# EAGLE design ROM-el HN61256_v2_TH (EAGLE 7.7.0)
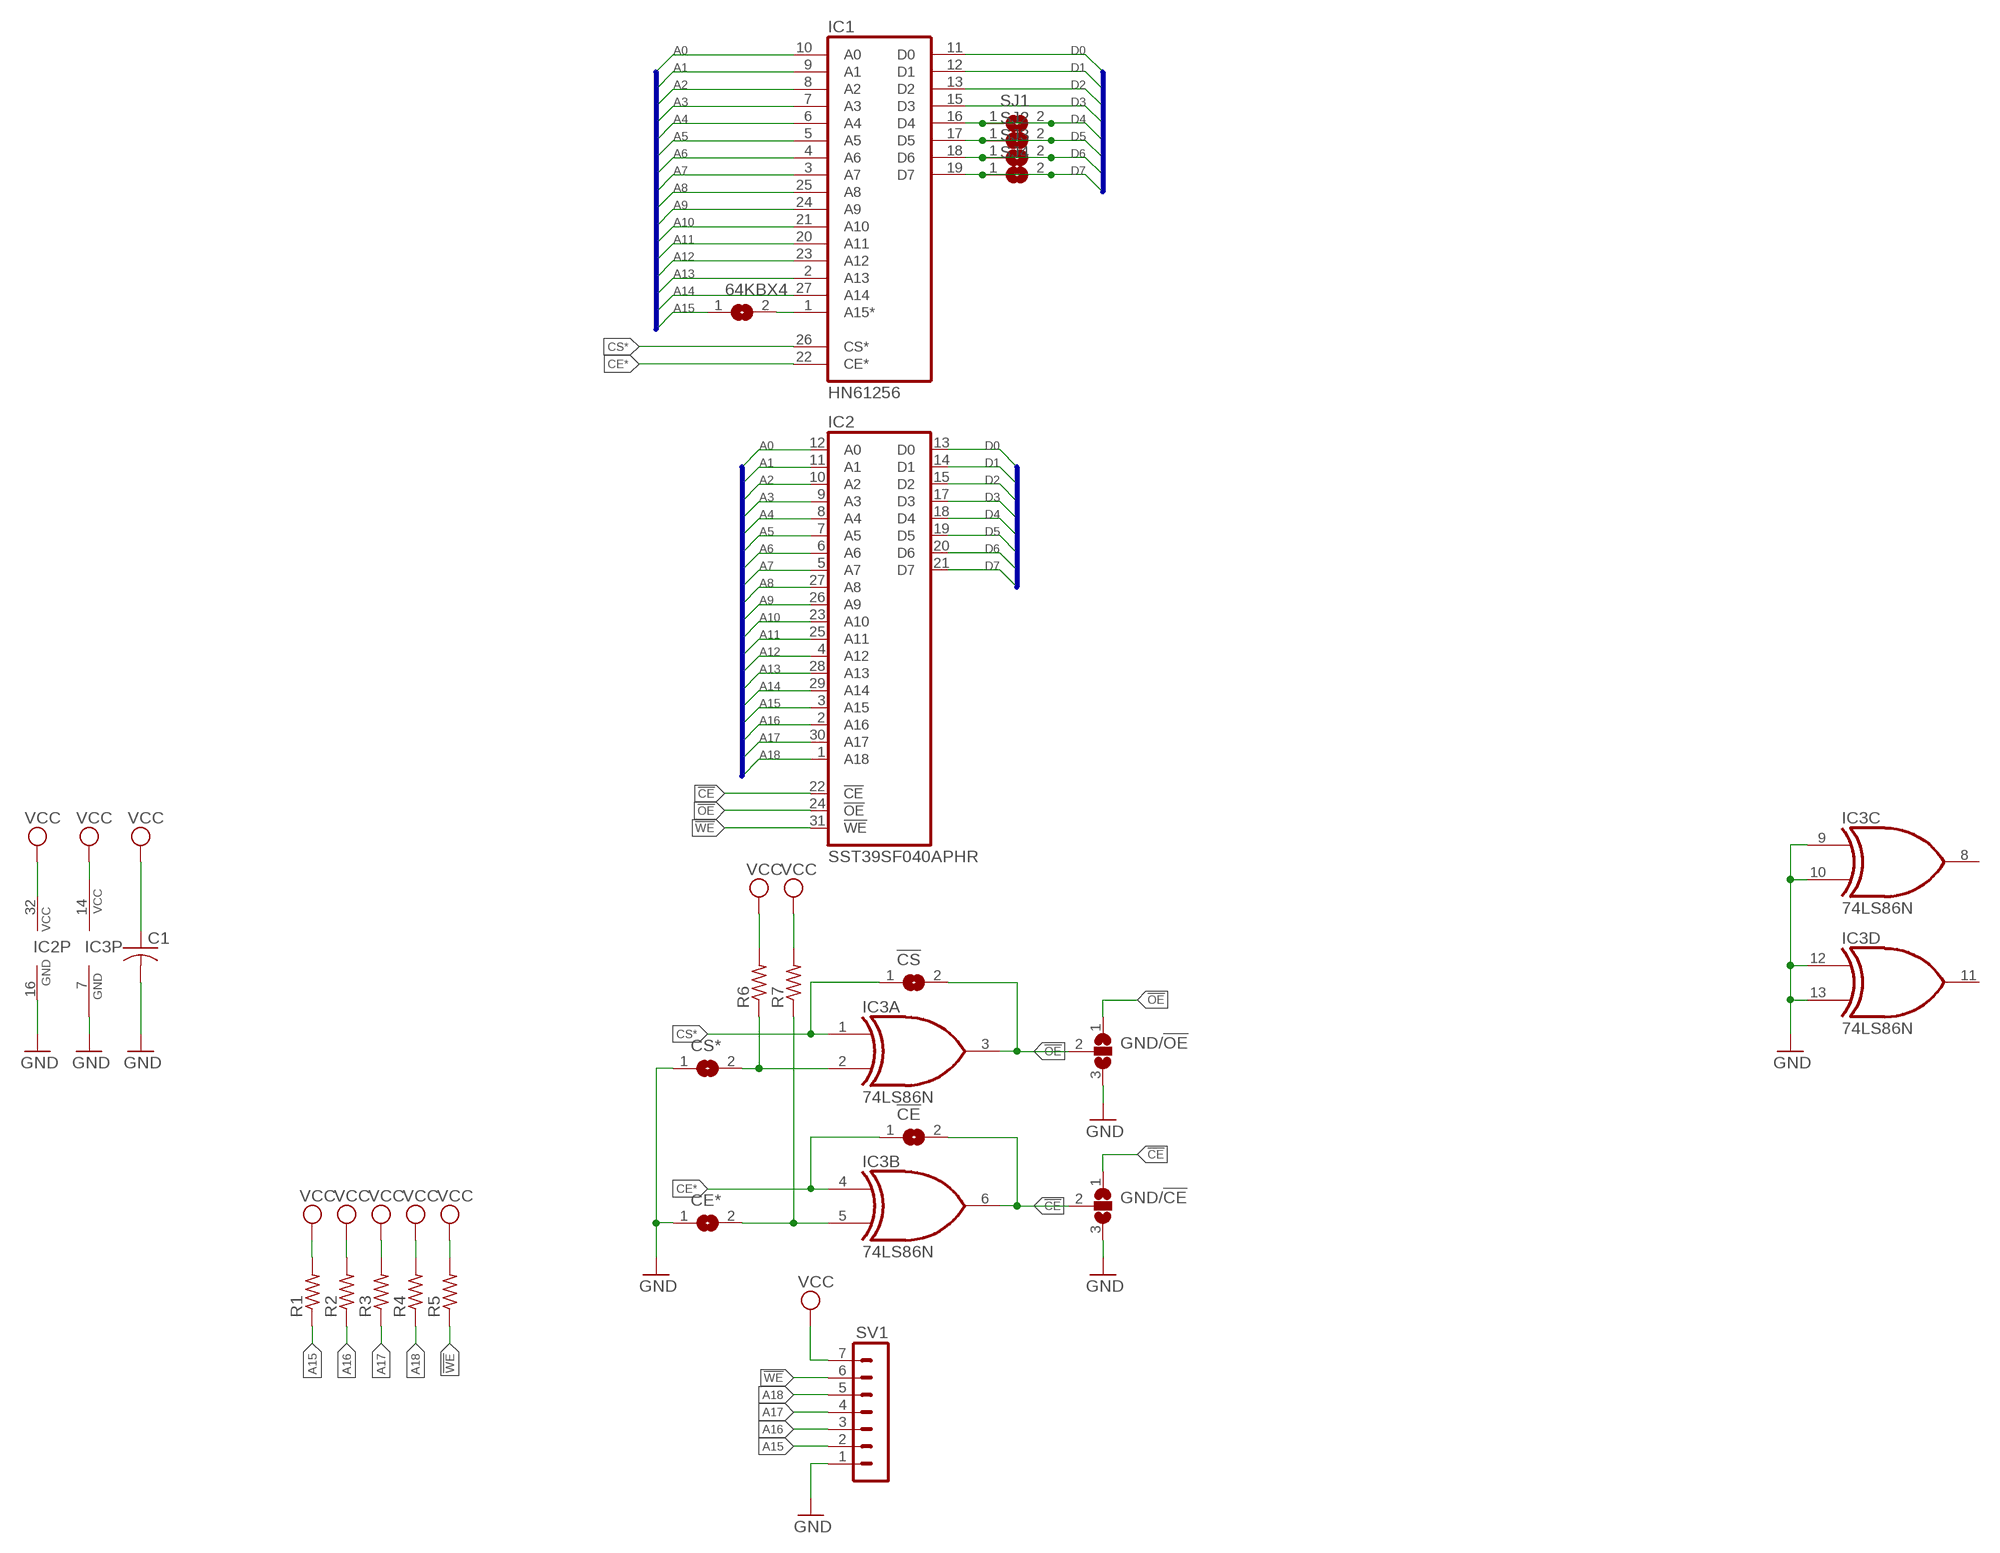
[diagram p0: schematic, sheet 1]

## Parts
64KBX4  SJ  [SJ]
!CE  SJ  [SJ]
!CS  SJ  [SJ]
C1  C-US025-025X050  [C025-025X050]
CE*  SJ  [SJ]
CS*  SJ  [SJ]
GND/!CE  SJ2W  [SJ_2]
GND/!OE  SJ2W  [SJ_2]
IC1  HN61256  [DIL28-6]
IC2  SST39SF040APHR  [DIL32-RP]
IC3  74LS86N  [DIL14-RP]
R1  R-US_0204/5  [0204/5]
R2  R-US_0204/5  [0204/5]
R3  R-US_0204/5  [0204/5]
R4  R-US_0204/5  [0204/5]
R5  R-US_0204/5  [0204/5]
R6  R-US_0204/5  [0204/5]
R7  R-US_0204/5  [0204/5]
SJ1  SJ  [SJ]
SJ2  SJ  [SJ]
SJ3  SJ  [SJ]
SJ4  SJ  [SJ]
SV1  MA07-1  [MA07-1]

## Nets
!CE: !CE.2 GND/!CE.1 GND/!CE.2 IC2.22(!CE) IC3.6(B:O)
!OE: !CS.2 GND/!OE.1 GND/!OE.2 IC2.24(!OE) IC3.3(A:O)
!WE: IC2.31(!WE) R5.1 SV1.6
A0: IC1.10(A0) IC2.12(A0)
A1: IC1.9(A1) IC2.11(A1)
A2: IC1.8(A2) IC2.10(A2)
A3: IC1.7(A3) IC2.9(A3)
A4: IC1.6(A4) IC2.8(A4)
A5: IC1.5(A5) IC2.7(A5)
A6: IC1.4(A6) IC2.6(A6)
A7: IC1.3(A7) IC2.5(A7)
A8: IC1.25(A8) IC2.27(A8)
A9: IC1.24(A9) IC2.26(A9)
A10: IC1.21(A10) IC2.23(A10)
A11: IC1.20(A11) IC2.25(A11)
A12: IC1.23(A12) IC2.4(A12)
A13: IC1.2(A13) IC2.28(A13)
A14: IC1.27(A14) IC2.29(A14)
A15: 64KBX4.1 IC2.3(A15) R1.1 SV1.2
A16: IC2.2(A16) R2.1 SV1.3
A17: IC2.30(A17) R3.1 SV1.4
A18: IC2.1(A18) R4.1 SV1.5
CE*: !CE.1 IC1.22(CE*) IC3.4(B:I0)
CS*: !CS.1 IC1.26(CS*) IC3.1(A:I0)
D0: IC1.11(D0) IC2.13(D0)
D1: IC1.12(D1) IC2.14(D1)
D2: IC1.13(D2) IC2.15(D2)
D3: IC1.15(D3) IC2.17(D3)
D4: IC1.16(D4) IC2.18(D4) SJ1.1 SJ1.2
D5: IC1.17(D5) IC2.19(D5) SJ2.1 SJ2.2
D6: IC1.18(D6) IC2.20(D6) SJ3.1 SJ3.2
D7: IC1.19(D7) IC2.21(D7) SJ4.1 SJ4.2
GND: C1.2 CE*.1 CS*.1 GND/!CE.3 GND/!OE.3 IC2.16(GND) IC3.7(P:GND) IC3.9(C:I0) IC3.10(C:I1) IC3.12(D:I0) IC3.13(D:I1) SV1.1
N$1: 64KBX4.2 IC1.1(A15*)
N$7: CS*.2 IC3.2(A:I1) R6.1
N$8: CE*.2 IC3.5(B:I1) R7.1
VCC: C1.1 IC2.32(VCC) IC3.14(P:VCC) R1.2 R2.2 R3.2 R4.2 R5.2 R6.2 R7.2 SV1.7
Unconnected: IC3.8(C:O) IC3.11(D:O)

## Buses
A[0..18]
D[0..7]

## Power pins joined to a net without a drawn wire
GND: IC1.14(GND)
VCC: IC1.28(VCC)

## Library data of the parts
64KBX4 !CE !CS CE* CS* SJ1-SJ4 = jumper-jlb:SJ: SMD solder JUMPER
C1 = rcl:C-US: CAPACITOR, American symbol
GND/!CE GND/!OE = jumper-jlb:SJ2W: SMD solder JUMPER
IC1 = memory-hitachi-jlb:HN61256
IC2 = memory-sst:SST39SF040A: 4 Mbit x8 Multi-Purpose Flash Source: http://www.sst.com/dotAsset/40782.pdf
IC3 = 74xx-us-jlb:74*86: Quad 2-input EXCLUSIV-OR (XOR) gate
R1-R7 = resistor:R-US_: RESISTOR, American symbol
SV1 = con-lstb-rp:MA07-1: PIN HEADER; OC_FARNELL: unknown; OC_NEWARK: unknown

## Board
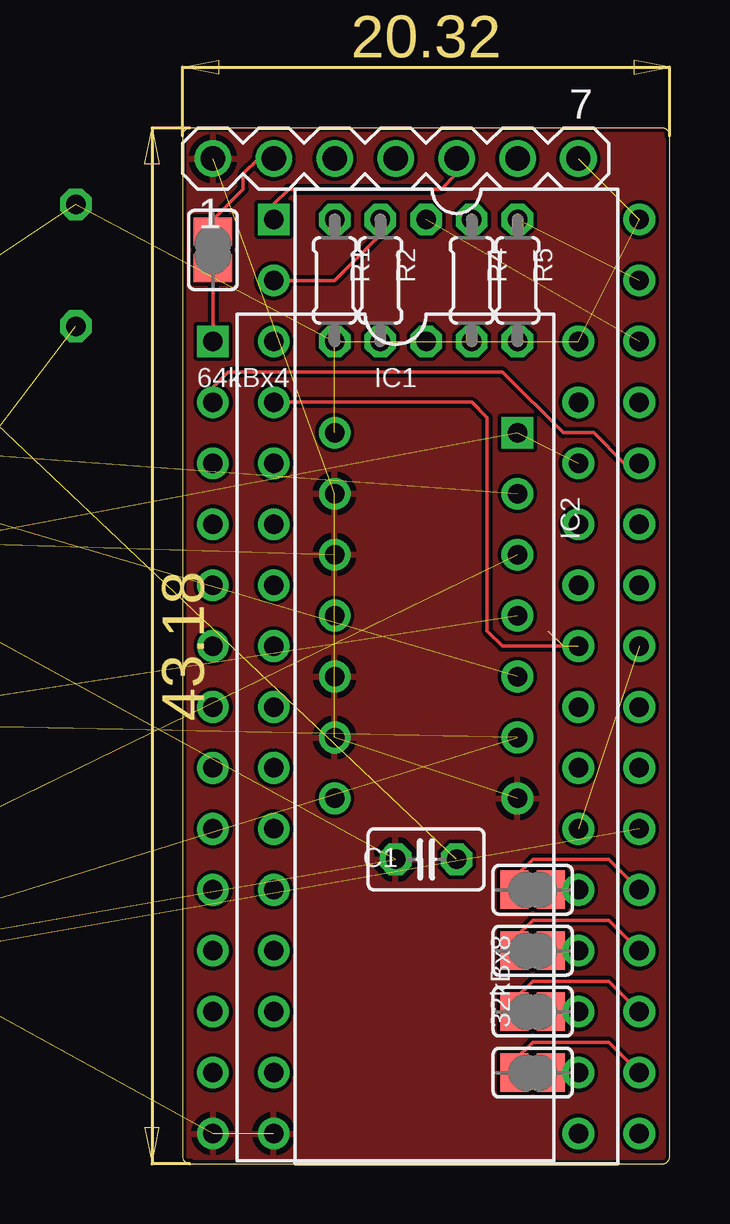
[diagram p1: board, top side]
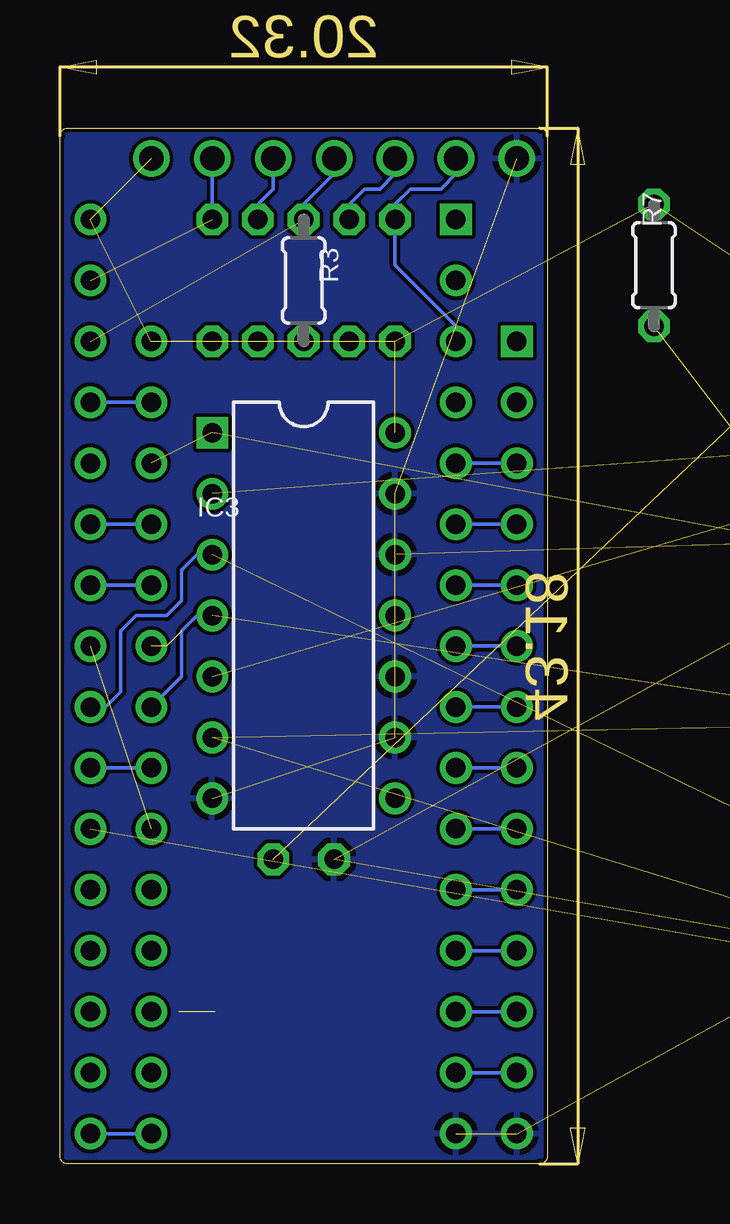
[diagram p2: board, bottom side, seen from below]

Size 20.32 x 43.18 mm. Coordinates in mm from the lower left corner, seen from the top.
Outline: 0,42.86 0,0.32 arc90 0.32,0 20,0 arc90 20.32,0.32 20.32,42.86 arc90 20,43.18 0.32,43.18 arc90 0,42.86
Copper layers (1*16): Top 0.035mm / dielectric 1.5mm / Bottom 0.035mm
Design rules "hackvana": minimum track width 6mil, minimum drill 0.3mm, track to track 6mil, track to pad 6mil, pad to pad 6mil, via to via 6mil, smd to smd 0mil, copper to edge 6mil, drill to drill 6mil, minimum pad ring 10mil, minimum via ring 6mil, stop-mask expansion 2mil, vias tented up to drill 100mil, thermal gap 10mil

### Footprints (pad centres in the part's own frame; a part is rotated, then mirrored left to right if it is on the bottom)
SJ = smd 1.168 x 1.6: 1 -0.762,0; 2 0.762,0
C025-025X050 = drill 0.813 octagon: 1 -1.27,0; 2 1.27,0
SJ_2 = smd 1.168 x 1.6: 1 -1.524,0; 2 0,0; 3 1.524,0
DIL28-6 = drill 0.813 square: 1 -16.51,-7.62 | drill 0.813: 2 -13.97,-7.62; 3 -11.43,-7.62; 4 -8.89,-7.62; 5 -6.35,-7.62; 6 -3.81,-7.62; 7 -1.27,-7.62; 8 1.27,-7.62; 9 3.81,-7.62; 10 6.35,-7.62; 11 8.89,-7.62; 12 11.43,-7.62; 13 13.97,-7.62; 14 16.51,-7.62; 15 16.51,7.62; 16 13.97,7.62; 17 11.43,7.62; 18 8.89,7.62; 19 6.35,7.62; 20 3.81,7.62; 21 1.27,7.62; 22 -1.27,7.62; 23 -3.81,7.62; 24 -6.35,7.62; 25 -8.89,7.62; 26 -11.43,7.62; 27 -13.97,7.62; 28 -16.51,7.62
DIL32-RP = drill 0.813 square: 1 -19.05,-7.62 | drill 0.813: 2 -16.51,-7.62; 3 -13.97,-7.62; 4 -11.43,-7.62; 5 -8.89,-7.62; 6 -6.35,-7.62; 7 -3.81,-7.62; 8 -1.27,-7.62; 9 1.27,-7.62; 10 3.81,-7.62; 11 6.35,-7.62; 12 8.89,-7.62; 13 11.43,-7.62; 14 13.97,-7.62; 15 16.51,-7.62; 16 19.05,-7.62; 17 19.05,7.62; 18 16.51,7.62; 19 13.97,7.62; 20 11.43,7.62; 21 8.89,7.62; 22 6.35,7.62; 23 3.81,7.62; 24 1.27,7.62; 25 -1.27,7.62; 26 -3.81,7.62; 27 -6.35,7.62; 28 -8.89,7.62; 29 -11.43,7.62; 30 -13.97,7.62; 31 -16.51,7.62; 32 -19.05,7.62
DIL14-RP = drill 0.813 square: 1 -7.62,-3.81 | drill 0.813: 2 -5.08,-3.81; 3 -2.54,-3.81; 4 0,-3.81; 5 2.54,-3.81; 6 5.08,-3.81; 7 7.62,-3.81; 8 7.62,3.81; 9 5.08,3.81; 10 2.54,3.81; 11 0,3.81; 12 -2.54,3.81; 13 -5.08,3.81; 14 -7.62,3.81
0204/5 = drill 0.813 octagon: 1 -2.54,0; 2 2.54,0
MA07-1 = drill 1.016: 1 -7.62,0; 2 -5.08,0; 3 -2.54,0; 4 0,0; 5 2.54,0; 6 5.08,0; 7 7.62,0

### Placement (x,y rotation side)
64KBX4  1.27,38.1 270 top
!CE  -24.13,17.78 90 top  (outside the outline)
!CS  -22.54,22.86 270 top  (outside the outline)
C1  10.16,12.7 180 top
CE*  -10.16,26.67 90 top  (outside the outline)
CS*  -15.24,26.67 90 top  (outside the outline)
GND/!CE  -9.84,8.89 270 top  (outside the outline)
GND/!OE  -14.29,10.16 270 top  (outside the outline)
IC1  8.89,17.78 270 top
IC2  11.43,20.32 270 top
IC3  10.16,22.86 270 bottom
R1  6.35,36.83 270 top
R2  8.26,36.83 270 top
R3  10.16,36.83 270 bottom
R4  12.07,36.83 270 top
R5  13.97,36.83 270 top
R6  -12.06,32.38 90 bottom  (outside the outline)
R7  -4.45,37.47 90 bottom  (outside the outline)
SJ1  14.61,3.81 180 top
SJ2  14.61,6.35 180 top
SJ3  14.61,8.89 180 top
SJ4  14.61,11.43 180 top
SV1  8.89,41.91 0 top

### Tracks (layer width: path | path; a pad name or v marks a point on that pad's centre or on a via)
!CE  (4 unrouted)
!OE  (3 unrouted)
  Bottom 0.152: IC3.3 14.61,25.4 15.24,24.77 15.24,23.5 15.88,22.86 17.15,22.86 17.78,22.23 17.78,19.68 18.41,19.05 IC2.24
!WE  (1 unrouted)
  Bottom 0.152: SV1.6 R5.1
A0
  Bottom 0.152: IC1.10 IC2.12
A1
  Bottom 0.152: IC2.11 IC1.9
A2
  Bottom 0.152: IC1.8 IC2.10
A3
  Bottom 0.152: IC1.7 IC2.9
A4
  Bottom 0.152: IC2.8 IC1.6
A5
  Bottom 0.152: IC1.5 IC2.7
A6
  Bottom 0.152: IC1.4 IC2.6
A7
  Bottom 0.152: IC1.3 IC2.5
A8
  Bottom 0.152: IC1.25 IC2.27
A9
  Bottom 0.152: IC1.24 IC2.26
A10
  Bottom 0.152: IC1.21 IC2.23
A11  (1 unrouted)
A12  (2 unrouted)
  Top 0.152: IC2.4 12.07,31.75 12.7,31.11 12.7,22.23 13.34,21.59 IC1.23
A13
  Top 0.152: IC2.28 18.41,29.21 17.15,30.48 15.88,30.48 13.34,33.02 1.91,33.02 1.27,32.38 IC1.2
A14
  Bottom 0.152: IC1.27 IC2.29
A15
  Top 0.152: 64KBX4.1 1.27,39.37 2.54,40.64 2.54,41.27 3.18,41.91 SV1.2
  Bottom 0.152: SV1.2 3.81,41.27 4.45,40.64 5.72,40.64 6.35,40.01 R1.1 6.35,37.47 3.81,34.92 IC2.3
A16
  Top 0.152: R2.1 8.26,38.73 6.35,36.83 IC2.2
  Bottom 0.152: R2.1 8.26,40.01 7.62,40.64 6.99,40.64 6.35,41.27 SV1.3
A17  (1 unrouted)
  Bottom 0.152: SV1.4 8.89,41.27 10.16,40.01 R3.1
A18
  Top 0.152: IC2.1 3.81,40.01 4.45,40.64 10.79,40.64 11.43,41.27 SV1.5
  Bottom 0.152: SV1.5 11.43,40.64 12.07,40.01 R4.1
CE*  (1 unrouted)
  Bottom 0.152: IC1.22 15.24,20.32 15.24,22.23 14.61,22.86 IC3.4
CS*  (2 unrouted)
D0
  Bottom 0.152: IC2.13 IC1.11
D1
  Bottom 0.152: IC1.12 IC2.14
D2
  Bottom 0.152: IC2.15 IC1.13
D3
  Bottom 0.152: IC2.17 IC1.15
D4
  Top 0.152: IC2.18 17.78,5.08 14.61,5.08 13.84,4.32 SJ1.2 SJ1.1 IC1.16
D5  (1 unrouted)
  Top 0.152: IC2.19 17.78,7.62 14.61,7.62 13.84,6.86 SJ2.2 | SJ2.1 IC1.17
D6
  Top 0.152: IC2.20 17.78,10.16 14.61,10.16 13.84,9.4 SJ3.2 SJ3.1 IC1.18
D7
  Top 0.152: IC2.21 17.78,12.7 14.61,12.7 13.84,11.94 SJ4.2 SJ4.1 IC1.19
GND  (12 unrouted)
  pour Top: 20.32,42.86 20.32,0.32 arc-90 20,0 0.32,0 arc-90 0,0.32 0,42.86 arc-90 0.32,43.18 20,43.18 arc-90
  pour Bottom: 20.32,42.86 20.32,0.32 arc-90 20,0 0.32,0 arc-90 0,0.32 0,42.86 arc-90 0.32,43.18 20,43.18 arc-90
N$1
  Top 0.152: 64KBX4.2 IC1.1
N$7  (2 unrouted)
N$8  (2 unrouted)
VCC  (11 unrouted)

### Text on the board
tNames: 64kBx4 | 32kBx8